# Altium schematic sheet STM32.SchDoc
size A4; SheetNumber: 2; SheetTotal: 3
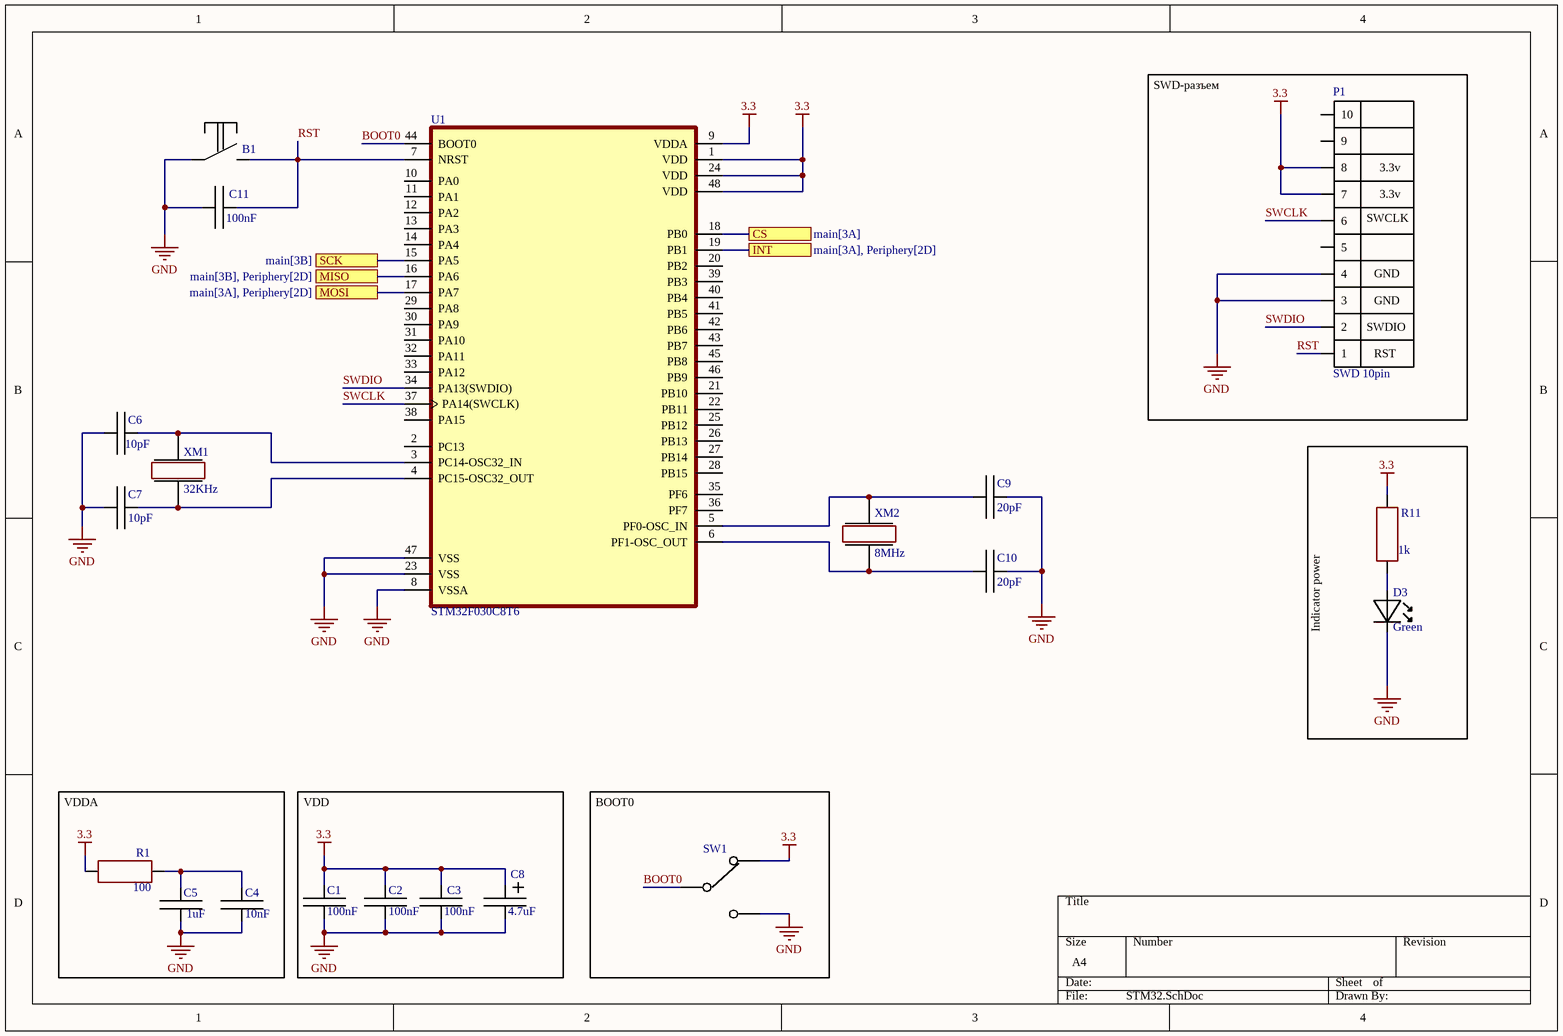
[diagram p0: STM32.SchDoc]

## Parts
B1  Knopka  [knopka]  (value not drawn)
C1  100nF  [C0805]
C2  100nF  [C0805]
C3  100nF  [C0805]
C4  10nF  [C0805]
C5  1uF  [C0805]
C6  10pF  [C0805]
C7  10pF  [C0805]
C8  4.7uF  [CAP_3.5 (8x12мм)]
C9  20pF  [C0805]
C10  20pF  [C0805]
C11  100nF  [C0805]
D3  Green  [LED0805]
P1  SWD 10pin  [SWD 10 pin]
R1  100  [R0805]
R11  1k  [R0805]
SW1  SW1  [PLS3]  (value not drawn)
U1  STM32F030C8T6  [STM32F030C8T6]
XM1  32KHz  [Resonator]
XM2  8MHz  [Resonator]

## Blocks framed on the sheet
Indicator power: D3 R11
VDDA: C4 C5 R1
VDD: C1-C3 C8
BOOT0: SW1

## Ports
CS (see main[3A]), INT (see main[3A], Periphery[2D]), MISO (see main[3B], Periphery[2D]), MOSI (see main[3A], Periphery[2D]), SCK (see main[3B])

## Nets
3.3: C1.2 C2.2 C3.2 C8.1 P1.7 P1.8 R1.2 R11.2 SW1.1 U1.1(VDD) U1.9(VDDA) U1.24(VDD) U1.48(VDD)
GND: B1.1 C1.1 C2.1 C3.1 C4.1 C5.1 C6.1 C7.1 C8.2 C9.2 C10.2 C11.1 D3.C P1.3 P1.4 SW1.3 U1.8(VSSA) U1.23(VSS) U1.47(VSS)
BOOT0: SW1.2 U1.44(BOOT0)
CS: U1.18(PB0) ; port CS
INT: U1.19(PB1) ; port INT
MISO: U1.16(PA6) ; port MISO
MOSI: U1.17(PA7) ; port MOSI
RST: B1.2 C11.2 P1.1 U1.7(NRST)
SCK: U1.15(PA5) ; port SCK
SWCLK: P1.6 U1.37(PA14(SWCLK))
SWDIO: P1.2 U1.34(PA13(SWDIO))
NetC4_2: C4.2 C5.2 R1.1
NetC6_2: C6.2 U1.3(PC14-OSC32_IN) XM1.2
NetC7_2: C7.2 U1.4(PC15-OSC32_OUT) XM1.1
NetC9_1: C9.1 U1.5(PF0-OSC_IN) XM2.2
NetC10_1: C10.1 U1.6(PF1-OSC_OUT) XM2.1
NetD3_A: D3.A R11.1

Not connected (* = marked no-connect by the designer): P1 5 9 10; U1 2(PC13) 10(PA0) 11(PA1) 12(PA2) 13(PA3) 14(PA4) 20(PB2) 21(PB10) 22(PB11) 25(PB12) 26(PB13) 27(PB14) 28(PB15) 29(PA8) 30(PA9) 31(PA10) 32(PA11) 33(PA12) 35(PF6) 36(PF7) 38(PA15) 39(PB3) 40(PB4) 41(PB5) 42(PB6) 43(PB7) 45(PB8) 46(PB9)

## Notes on the sheet
- SWD-разъем
- (near P1) 3.3v
- (near P1) SWCLK
- (near P1) GND
- (near P1) SWDIO
- (near P1) RST

## Library data of the parts
B1 = Knopka: SMD
C1-C7 C9-C11 = C0805: Керамический конденсатор. 1uF,10uF,106uF,33pF,100uF
C8 = C_3.5: Электролит конденсатор (8x12мм)
D3 = Led: SMD 0805
R1 R11 = R0805: SMD
SW1 = PLS3: для джампера
XM1 XM2 = Resonator